# EAGLE design Adafruit USB Type C Vertical Breakout (EAGLE 9.6.2)
COMPANY: ADAFRUIT INDUSTRIES; DRAWN: KTOWN; REV: A; YEAR: 2019
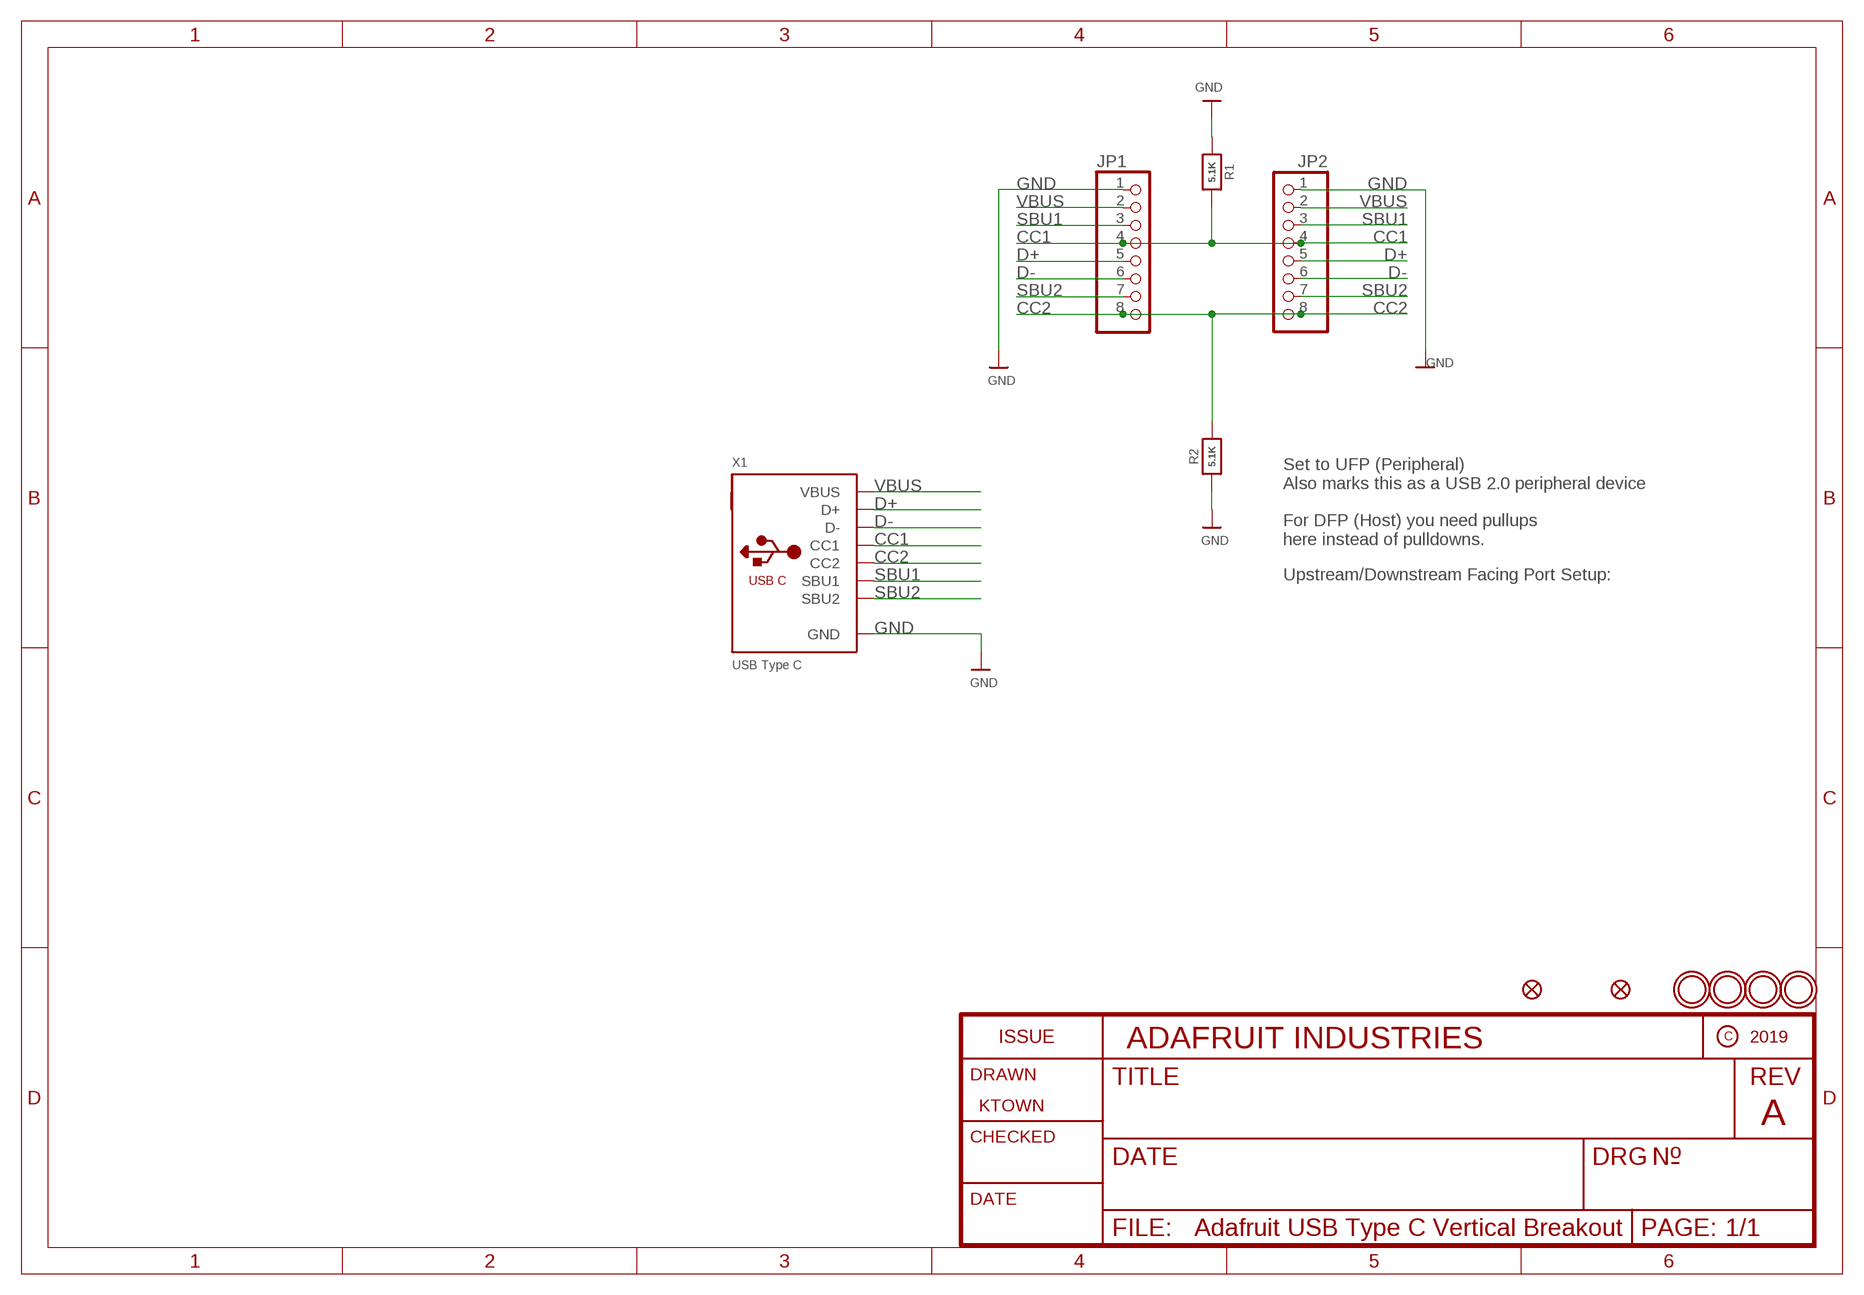
[diagram p0: schematic, sheet 1]

## Parts
FID1  FIDUCIAL_1MM  [FIDUCIAL_1MM]
FID2  FIDUCIAL_1MM  [FIDUCIAL_1MM]
JP1  HEADER-1X876MIL  [1X08_ROUND_76]
JP2  HEADER-1X876MIL  [1X08_ROUND_76]
R1  5.1K  RESISTOR_0603_NOOUT  [0603-NO]
R2  5.1K  RESISTOR_0603_NOOUT  [0603-NO]
U$1  MOUNTINGHOLE2.5  [MOUNTINGHOLE_2.5_PLATED]
U$2  MOUNTINGHOLE2.5  [MOUNTINGHOLE_2.5_PLATED]
U$10  MOUNTINGHOLE2.5  [MOUNTINGHOLE_2.5_PLATED]
U$11  MOUNTINGHOLE2.5  [MOUNTINGHOLE_2.5_PLATED]
X1  USB Type C  USB_C_VERTICAL  [USB_C_VERTICAL]

## Nets
CC1: JP1.4 JP2.4 R1.2 X1.A5(CC1)
CC2: JP1.8 JP2.8 R2.2 X1.B5(CC2)
D+: JP1.5 JP2.5 X1.A6(D+) X1.B6(D+)
D-: JP1.6 JP2.6 X1.A7(D-) X1.B7(D-)
GND: JP1.1 JP2.1 R1.1 R2.1 X1.A1(GND) X1.A12(GND) X1.B1(GND) X1.B12(GND) X1.P$1(GND) X1.P$2(GND) X1.P$3(GND) X1.P$4(GND)
SBU1: JP1.3 JP2.3 X1.A8(SBU1)
SBU2: JP1.7 JP2.7 X1.B8(SBU2)
VBUS: JP1.2 JP2.2 X1.A4(VBUS) X1.A9(VBUS) X1.B4(VBUS) X1.B9(VBUS)

## Notes on the sheet
- Set to UFP (Peripheral)
  Also marks this as a USB 2.0 peripheral device
  
  For DFP (Host) you need pullups
  here instead of pulldowns.
- Upstream/Downstream Facing Port Setup:

## Library data of the parts
FID1 FID2 = microbuilder:FIDUCIAL: Fiducial Alignment Points Various fiducial points for machine vision alignment.; BOM: EXCLUDE
JP1 JP2 = microbuilder:HEADER-1X8: PIN HEADER
R1 R2 = microbuilder:RESISTOR: Resistors For new designs, use the packages preceded by an '_' character since they are more reliable: The following footprints should be used on most boards: _0402 - Standard footprint for regular board layouts _0603 - Standard footprint for regular board layouts _0805 - Standard footprint for regular board layouts _1206 - Standard footprint for regular board layouts For extremely tight-pitch boards where space is at a premium, the following 'micro-pitch' footprints can be used (smaller pads, no silkscreen outline, etc.): _0402MP - Micro-pitch footprint for very dense/compact boards _0603MP - Micro-pitch footprint for very dense/compact boards _0805MP - Micro-pitch footprint for very dense/compact boards _1206MP - Micro-pitch footprint for very dense/compact boards
U$1 U$2 U$10 U$11 = adafruit_electromech:MOUNTINGHOLE: Mounting Hole For #2 screws (0.086"/2.18mm width, 0.094"/2.4mm hole) use 2.5mm; BOM: EXCLUDE
X1 = adafruit_electromech:USB_C_VERTICAL: USB C Vertical Connector Technical Specifications: Current Rating - Power (Max): 5A Operating Temperature: -55℃~+85℃ Number of contacts: 16P LCSC: C3039342 LCSC: C3039343

## Board
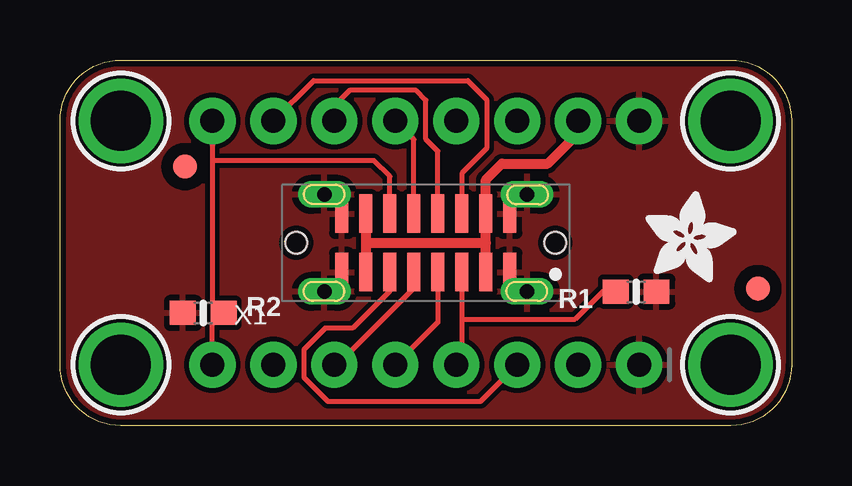
[diagram p1: board, top side]
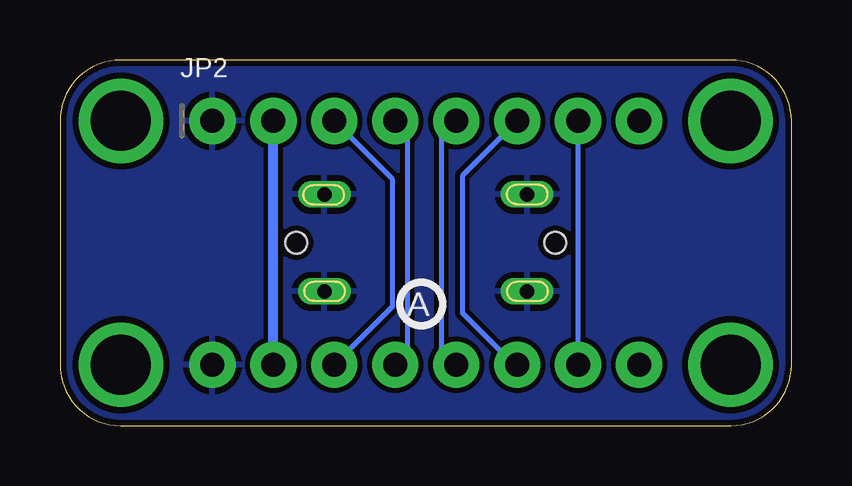
[diagram p2: board, bottom side, seen from below]

Size 30.48 x 15.24 mm. Coordinates in mm from the lower left corner, seen from the top.
Outline: 30.48,12.7 30.48,2.54 arc-90 27.94,0 2.54,0 arc-90 0,2.54 0,12.7 arc-90 2.54,15.24 27.94,15.24 arc-90 30.48,12.7
Copper layers (1*16): Top 0.035mm / dielectric 1.5mm / Bottom 0.035mm
Design rules "adafruit": minimum track width 8mil, minimum drill 15.5mil, track to track 8mil, track to pad 8mil, pad to pad 8mil, via to via 8mil, smd to smd 8mil, copper to edge 10mil, drill to drill 8mil, minimum pad ring 10mil, minimum via ring 8mil, stop-mask expansion 2mil, vias tented up to drill 20mil, thermal gap 10mil

### Footprints (pad centres in the part's own frame; a part is rotated, then mirrored left to right if it is on the bottom)
FIDUCIAL_1MM = smd 1 x 1: 1 0,0
1X08_ROUND_76 = drill 1 pad 1.93: 1 -8.89,0; 2 -6.35,0; 3 -3.81,0; 4 -1.27,0; 5 1.27,0; 6 3.81,0; 7 6.35,0; 8 8.89,0
0603-NO = smd 1.075 x 1: 1 -0.85,0; 2 0.85,0
MOUNTINGHOLE_2.5_PLATED = drill 2.5 pad 3.2: P$1 0,0
USB_C_VERTICAL = smd 0.55 x 1.6: A1 -3.5,1.22; A4 -2.5,1.22; A5 -1.5,1.22; A6 -0.5,1.22; A7 0.5,1.22; A8 1.5,1.22; A9 2.5,1.22; A12 3.5,1.22; B1 3.5,-1.22; B4 2.5,-1.22; B5 1.5,-1.22; B6 0.5,-1.22; B7 -0.5,-1.22; B8 -1.5,-1.22; B9 -2.5,-1.22; B12 -3.5,-1.22 | drill 0.6 pad 1 long: P$1 -4.225,-2.02; P$2 -4.225,2.02; P$3 4.225,-2.02; P$4 4.225,2.02 | hole 0.9: -5.4,0; 5.4,0

### Placement (x,y rotation side)
FID1  5.21,10.79 0 top
FID2  29.08,5.71 0 top
JP1  15.24,2.54 180 top
JP2  15.24,12.7 0 bottom
PLABEL0  [PLABEL0]  21.62,0.92 0 top
PLABEL1  [PLABEL1]  11.49,0.79 0 top
PLABEL2  [PLABEL2]  14,4.22 0 top
PLABEL3  [PLABEL3]  8.82,4.22 0 top
PLABEL4  [PLABEL4]  16.55,0.79 0 top
PLABEL5  [PLABEL5]  24.18,4.22 0 top
PLABEL6  [PLABEL6]  0.13,7.62 0 top
PLABEL7  [PLABEL7]  19.06,4.22 0 top
PLABEL8  [PLABEL8]  6.38,0.79 0 top
PLABEL9  [PLABEL9]  21.58,14.38 0 top
PLABEL10  [PLABEL10]  11.49,14.38 0 top
PLABEL11  [PLABEL11]  14,10.96 0 top
PLABEL12  [PLABEL12]  8.95,10.96 0 top
PLABEL13  [PLABEL13]  16.55,14.38 0 top
PLABEL14  [PLABEL14]  24.18,10.96 0 top
PLABEL15  [PLABEL15]  19.06,10.96 0 top
PLABEL16  [PLABEL16]  6.25,14.38 0 top
PLABEL17  [PLABEL17]  15.24,7.62 0 bottom
R1  24,5.59 180 top
R2  5.97,4.7 0 top
U$1  27.94,12.7 180 top
U$2  2.54,12.7 180 top
U$8  [PCBFEAT-REV-040]  15.43,5.07 180 bottom
U$10  2.54,2.54 0 top
U$11  27.94,2.54 0 top
U$12  [ADAFRUIT_3.5MM]  24.38,5.97 0 top
X1  15.24,7.62 180 top

### Tracks (layer width: path | path; a pad name or v marks a point on that pad's centre or on a via)
CC1
  Top 0.203: X1.A5 16.74,4.45 | 16.74,4.45 16.74,2.77 JP1.4 | 16.74,4.45 21.46,4.45 22.61,5.59 R1.2
  Bottom 0.203: JP2.4 16,12.19 16,3.05 JP1.4
CC2
  Top 0.203: JP2.8 6.35,11.05 | X1.B5 13.74,10.39 13.08,11.05 6.35,11.05 | 6.35,11.05 6.35,5.17 R2.2 6.35,4.23 JP1.8
D+
  Top 0.203: X1.A6 15.74,4.31 JP1.5 | X1.B6 14.74,11.93 JP2.5
  Bottom 0.203: JP2.5 14.61,12.06 14.61,3.17 JP1.5
D-
  Top 0.203: X1.A7 14.74,5.72 11.56,2.54 JP1.6 | X1.B7 15.74,11.44 15.24,11.94 15.24,13.56 14.83,13.97 12.06,13.97 11.43,13.34 JP2.6
  Bottom 0.203: JP2.6 13.72,10.41 13.72,4.7 11.56,2.54 JP1.6
GND
  pour Top: 0,15.24 30.48,15.24 30.48,0 0,0
  pour Bottom: 0,15.24 30.48,15.24 30.48,0 0,0
SBU1
  Top 0.203: X1.A8 13.74,5.61 12.19,4.06 11.05,4.06 10.16,3.17 10.16,2.01 11.16,1.02 17.53,1.02 JP1.3
  Bottom 0.203: JP2.3 16.64,10.29 16.64,4.95 JP1.3
SBU2
  Top 0.203: JP2.7 10.57,14.38 16.99,14.38 17.78,13.59 17.78,11.56 16.74,10.52 X1.B8
  Bottom 0.203: JP1.7 JP2.7
VBUS
  Top 0.406: X1.A4 17.74,7.62 | 17.74,7.62 X1.B9 17.74,10.25 18.41,10.92 20.32,10.92 21.59,12.19 JP2.2 | X1.B4 12.74,7.62 | 12.74,7.62 X1.A9 | 12.74,7.62 17.74,7.62
  Bottom 0.406: JP1.2 JP2.2

### Text on the board
Pinguin_tBackup: CC2 | D- | CC1 | VBUS | S2 | D+ | S1 | GND | USB Type C / Downstream / Vertical Port | S2 | D+ | S1 | GND | CC2 | D- | CC1 | VBUS
Pinguin_bBackup: adafruit!